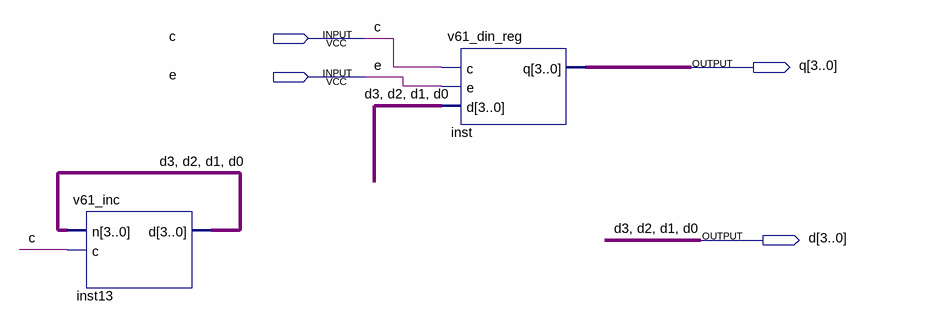
[diagram p0: schematic sheet]
// Quartus schematic ss61.bdf as structural Verilog: 2 symbols, 4 pins
module ss61 (
  input  c,
  input  e,
  output [3:0] q,
  output [3:0] d
);

  v61_inc inst13 (.n(d), .c(c), .d(d));
  v61_din_reg inst (.c(c), .e(e), .d(d), .q(q));
endmodule
